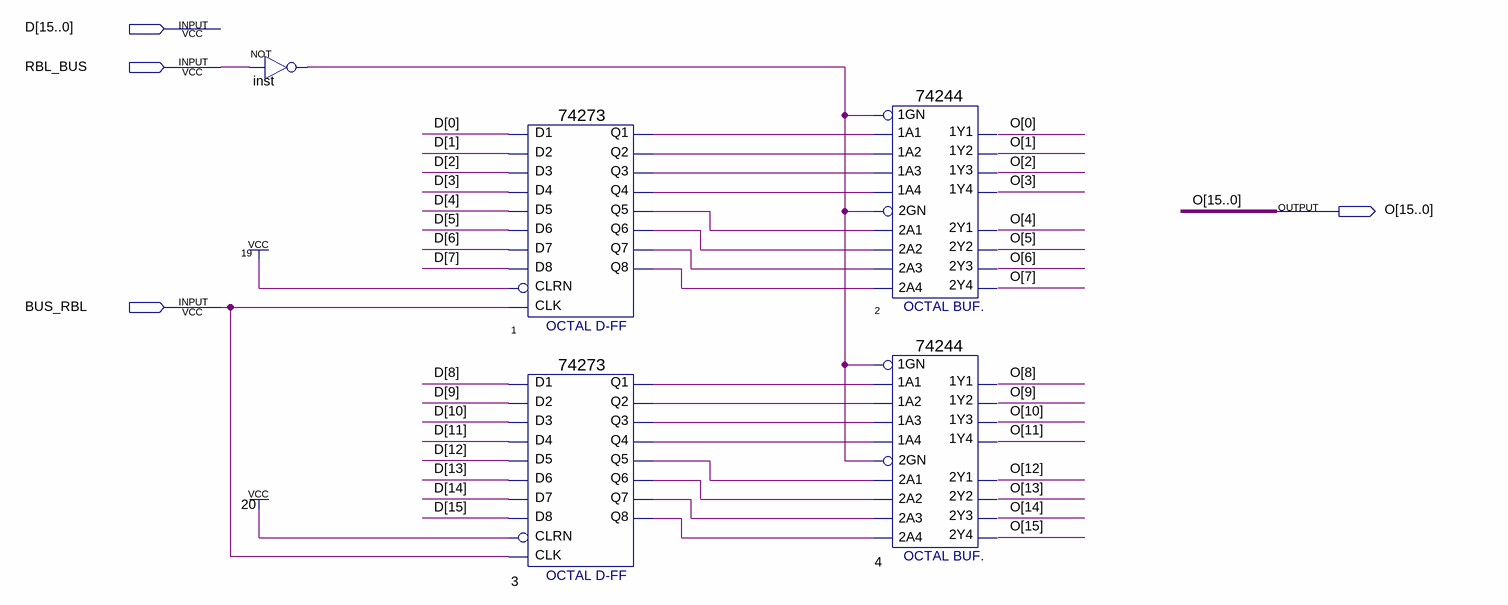
[diagram p0: schematic sheet]
// Quartus schematic RBL1.bdf as structural Verilog: 5 symbols, 4 pins
module RBL1 (
  input  [15:0] D,
  input  RBL_BUS,
  input  BUS_RBL,
  output [15:0] O
);

  wire inst_out, n1_q1, n1_q2, n1_q3, n1_q4, n1_q5, n1_q6, n1_q7, n1_q8, n3_q1, n3_q2, n3_q3, n3_q4, n3_q5,
       n3_q6, n3_q7, n3_q8;

  not inst (inst_out, RBL_BUS);
  \74273  u_1 (
    .D1(D[0]), .D2(D[1]), .D3(D[2]), .D4(D[3]), .D5(D[4]), .D6(D[5]), .D7(D[6]), .CLK(BUS_RBL), .D8(D[7]),
    .CLRN(1'b1), .Q1(n1_q1), .Q2(n1_q2), .Q3(n1_q3), .Q4(n1_q4), .Q5(n1_q5), .Q6(n1_q6), .Q7(n1_q7),
    .Q8(n1_q8));
  \74273  u_3 (
    .D1(D[8]), .D2(D[9]), .D3(D[10]), .D4(D[11]), .D5(D[12]), .D6(D[13]), .D7(D[14]), .CLK(BUS_RBL),
    .D8(D[15]), .CLRN(1'b1), .Q1(n3_q1), .Q2(n3_q2), .Q3(n3_q3), .Q4(n3_q4), .Q5(n3_q5), .Q6(n3_q6),
    .Q7(n3_q7), .Q8(n3_q8));
  \74244  u_2 (
    .\1A2 (n1_q2), .\1A1 (n1_q1), .\1A4 (n1_q4), .\1A3 (n1_q3), .\1GN (inst_out), .\2A1 (n1_q5),
    .\2GN (inst_out), .\2A3 (n1_q7), .\2A2 (n1_q6), .\2A4 (n1_q8), .\1Y2 (O[1]), .\1Y1 (O[0]), .\2Y1 (O[4]),
    .\1Y4 (O[3]), .\1Y3 (O[2]), .\2Y4 (O[7]), .\2Y3 (O[6]), .\2Y2 (O[5]));
  \74244  u_4 (
    .\1A2 (n3_q2), .\1A1 (n3_q1), .\1A4 (n3_q4), .\1A3 (n3_q3), .\1GN (inst_out), .\2A1 (n3_q5),
    .\2GN (inst_out), .\2A3 (n3_q7), .\2A2 (n3_q6), .\2A4 (n3_q8), .\1Y2 (O[9]), .\1Y1 (O[8]), .\2Y1 (O[12]),
    .\1Y4 (O[11]), .\1Y3 (O[10]), .\2Y4 (O[15]), .\2Y3 (O[14]), .\2Y2 (O[13]));
endmodule
